# Altium schematic sheet STM32H7-Board.SchDoc
size A4
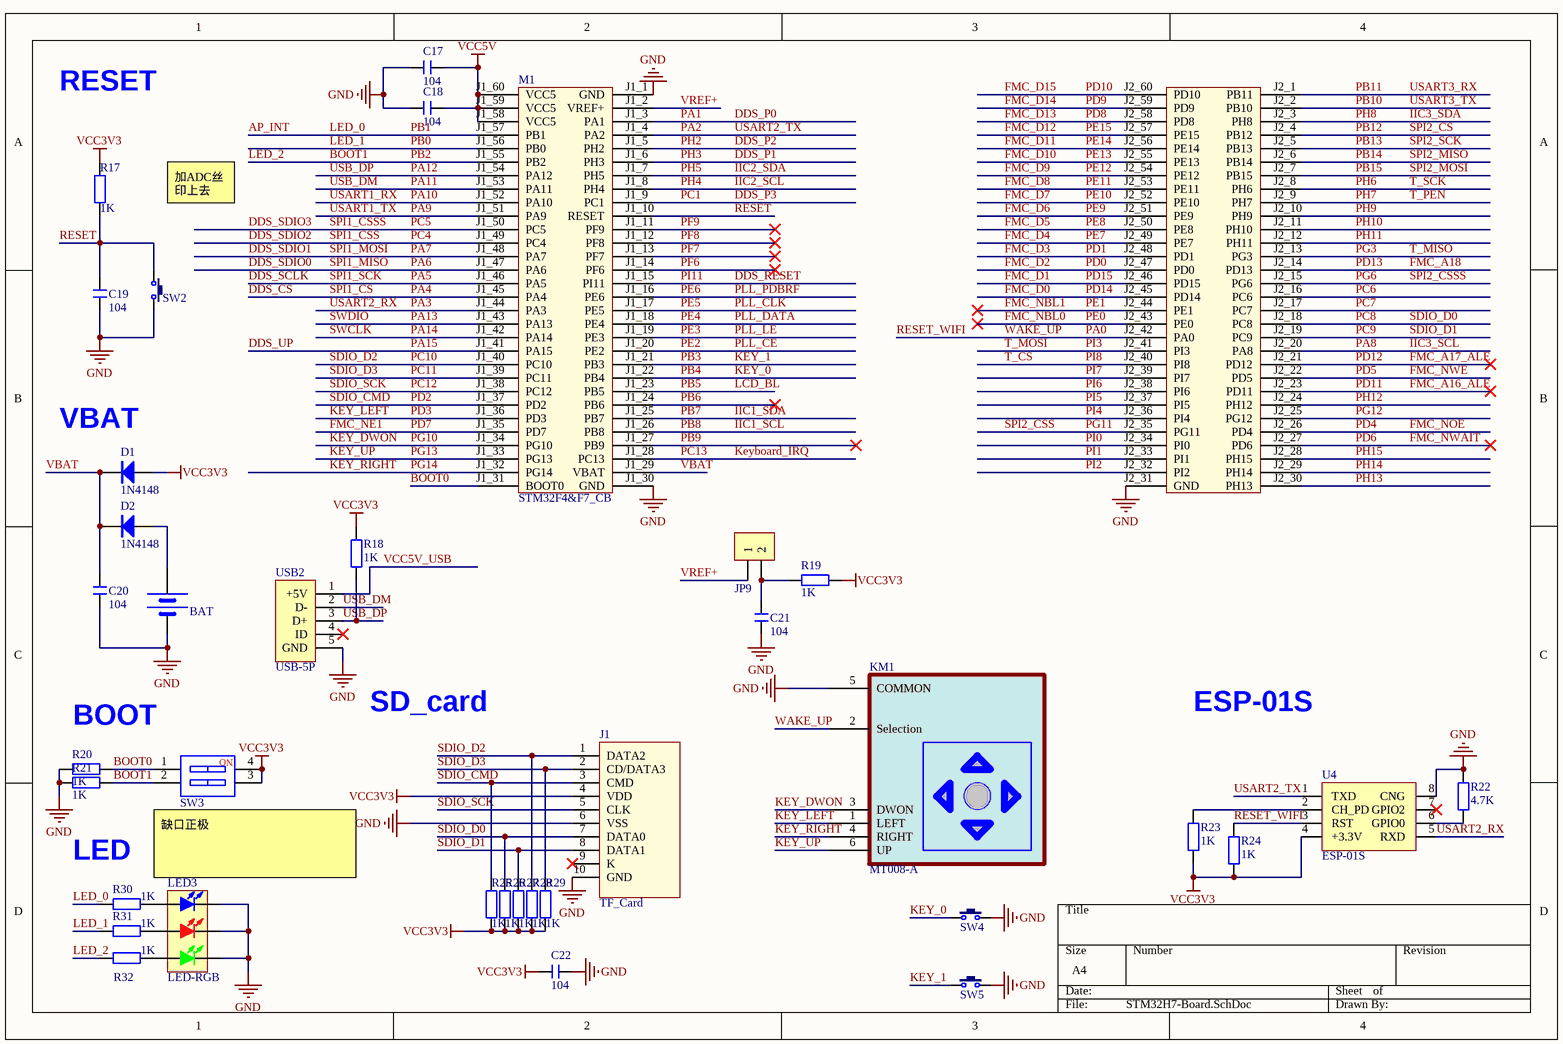
[diagram p0: STM32H7-Board.SchDoc]

## Parts
BAT  BATT  [BATM]  (value not drawn)
C17  104  [C 0603_L]
C18  104  [C 0603_L]
C19  104  [C 0603_L]
C20  104  [C 0603_L]
C21  104  [C 0603_L]
C22  104  [C 0603_L]
D1  1N4148  [SOD-323]
D2  1N4148  [MINI_MELF (LL34)]
J1  TF_Card  [Micro SD]
JP9  HDR-1X2  [HDR2.54-LI-2P]  (value not drawn)
KM1  MT008-A  [JOY_MT008-A]
LED3  LED-RGB  [LED 5050]
M1  STM32F4&F7_CB  [STM32F4&F7_CB]
R17  1K  [R 0603_L]
R18  1K  [R 0603_L]
R19  1K  [R 0603_L]
R20  1K  [R 0603_L]
R21  1K  [R 0603_L]
R22  4.7K  [R 0603_L]
R23  1K  [R 0603_L]
R24  1K  [R 0603_L]
R25  1K  [R 0603_L]
R26  1K  [R 0603_L]
R27  1K  [R 0603_L]
R28  1K  [R 0603_L]
R29  1K  [R 0603_L]
R30  1K  [R 0603_L]
R31  1K  [R 0603_L]
R32  1K  [R 0603_L]
SW2  3x6x5  [TSW SMD-3*6*2.5]  (value not drawn)
SW3  CSW-2P  [CSW1.27 SMD-2P]  (value not drawn)
SW4  3x6x5  [SODFL700X110-2N]  (value not drawn)
SW5  3x6x5  [SODFL700X110-2N]  (value not drawn)
U4  ESP-01S  [ESP-01S]
USB2  USB-5P  [USB-MICRO_B]

## Nets
GND: BAT.2(GND) C17.1 C18.1 C19.1 C20.1 C21.1 C22.2 J1.6(VSS) J1.10(GND) KM1.5(COMMON) LED3.2(BULE_K) LED3.4(RED_K) LED3.6(GREEN_K) M1.J1_1(GND) M1.J1_30(GND) M1.J2_31(GND) R20.1 R21.1 R22.2 SW2.2 SW4.2 SW5.2 U4.8(CNG) USB2.5(GND)
VCC3V3: C22.1 D1.1(A) J1.4(VDD) R17.2 R18.1 R19.2 R23.2 R24.2 R25.1 R26.1 R27.1 R28.1 R29.1 SW3.3 SW3.4 U4.4(+3.3V)
VCC5V: C17.2 C18.2 M1.J1_58(VCC5) M1.J1_59(VCC5) M1.J1_60(VCC5)
AP_INT: M1.J1_57(PB1) R30.2  [also labelled LED_0, PB1]
BOOT0: M1.J1_31(BOOT0) R20.2 SW3.1
BOOT1: M1.J1_55(PB2) R21.2 R32.2 SW3.2  [also labelled LED_2, PB2]
DDS_CS: M1.J1_45(PA4)  [also labelled PA4, SPI1_CS]
DDS_P0: M1.J1_3(PA1)  [also labelled PA1]
DDS_P1: M1.J1_6(PH3)  [also labelled PH3]
DDS_P2: M1.J1_5(PH2)  [also labelled PH2]
DDS_P3: M1.J1_9(PC1)  [also labelled PC1]
DDS_RESET: M1.J1_15(PI11)  [also labelled PI11]
DDS_SCLK: M1.J1_46(PA5)  [also labelled PA5, SPI1_SCK]
DDS_SDIO0: M1.J1_47(PA6)  [also labelled PA6, SPI1_MISO]
DDS_SDIO1: M1.J1_48(PA7)  [also labelled PA7, SPI1_MOSI]
DDS_SDIO2: M1.J1_49(PC4)  [also labelled PC4, SPI1_CSS]
DDS_SDIO3: M1.J1_50(PC5)  [also labelled PC5, SPI1_CSSS]
DDS_UP: M1.J1_41(PA15)  [also labelled PA15]
FMC_A16_ALE: M1.J2_23(PD11)  [also labelled PD11]
FMC_A17_ALE: M1.J2_21(PD12)  [also labelled PD12]
FMC_A18: M1.J2_14(PD13)  [also labelled PD13]
FMC_D0: M1.J2_45(PD14)  [also labelled PD14]
FMC_D1: M1.J2_46(PD15)  [also labelled PD15]
FMC_D2: M1.J2_47(PD0)  [also labelled PD0]
FMC_D3: M1.J2_48(PD1)  [also labelled PD1]
FMC_D4: M1.J2_49(PE7)  [also labelled PE7]
FMC_D5: M1.J2_50(PE8)  [also labelled PE8]
FMC_D6: M1.J2_51(PE9)  [also labelled PE9]
FMC_D7: M1.J2_52(PE10)  [also labelled PE10]
FMC_D8: M1.J2_53(PE11)  [also labelled PE11]
FMC_D9: M1.J2_54(PE12)  [also labelled PE12]
FMC_D10: M1.J2_55(PE13)  [also labelled PE13]
FMC_D11: M1.J2_56(PE14)  [also labelled PE14]
FMC_D12: M1.J2_57(PE15)  [also labelled PE15]
FMC_D13: M1.J2_58(PD8)  [also labelled PD8]
FMC_D14: M1.J2_59(PD9)  [also labelled PD9]
FMC_D15: M1.J2_60(PD10)  [also labelled PD10]
FMC_NBL0: M1.J2_43(PE0)  [also labelled PE0]
FMC_NBL1: M1.J2_44(PE1)  [also labelled PE1]
FMC_NE1: M1.J1_35(PD7)  [also labelled PD7]
FMC_NOE: M1.J2_26(PD4)  [also labelled PD4]
FMC_NWAIT: M1.J2_27(PD6)  [also labelled PD6]
FMC_NWE: M1.J2_22(PD5)  [also labelled PD5]
IIC1_SCL: M1.J1_26(PB8)  [also labelled PB8]
IIC1_SDA: M1.J1_25(PB7)  [also labelled PB7]
IIC2_SCL: M1.J1_8(PH4)  [also labelled PH4]
IIC2_SDA: M1.J1_7(PH5)  [also labelled PH5]
IIC3_SCL: M1.J2_20(PA8)  [also labelled PA8]
IIC3_SDA: M1.J2_3(PH8)  [also labelled PH8]
KEY_0: M1.J1_22(PB4) SW4.1  [also labelled PB4]
KEY_1: M1.J1_21(PB3) SW5.1  [also labelled PB3]
KEY_DWON: KM1.3(DWON) M1.J1_34(PG10)  [also labelled PG10]
KEY_LEFT: KM1.1(LEFT) M1.J1_36(PD3)  [also labelled PD3]
KEY_RIGHT: KM1.4(RIGHT) M1.J1_32(PG14)  [also labelled PG14]
KEY_UP: KM1.6(UP) M1.J1_33(PG13)  [also labelled PG13]
Keyboard_IRQ: M1.J1_28(PC13)  [also labelled PC13]
LCD_BL: M1.J1_23(PB5)  [also labelled PB5]
LED_1: M1.J1_56(PB0) R31.2  [also labelled PB0]
PA0: KM1.2(Selection) M1.J2_42(PA0) R24.1 U4.3(RST)  [also labelled RESET_WIFI, WAKE_UP]
PA2: M1.J1_4(PA2) U4.1(TXD)  [also labelled USART2_TX]
PA3: M1.J1_44(PA3) U4.5(RXD)  [also labelled USART2_RX]
PA9: M1.J1_51(PA9)  [also labelled USART1_TX]
PA10: M1.J1_52(PA10)  [also labelled USART1_RX]
PA11: M1.J1_53(PA11) USB2.2(D-)  [also labelled USB_DM]
PA12: M1.J1_54(PA12) R18.2 USB2.3(D+)  [also labelled USB_DP]
PA13: M1.J1_43(PA13)  [also labelled SWDIO]
PA14: M1.J1_42(PA14)  [also labelled SWCLK]
PB6: M1.J1_24(PB6)
PB9: M1.J1_27(PB9)
PB10: M1.J2_2(PB10)  [also labelled USART3_TX]
PB11: M1.J2_1(PB11)  [also labelled USART3_RX]
PB12: M1.J2_4(PB12)  [also labelled SPI2_CS]
PB13: M1.J2_5(PB13)  [also labelled SPI2_SCK]
PB14: M1.J2_6(PB14)  [also labelled SPI2_MISO]
PB15: M1.J2_7(PB15)  [also labelled SPI2_MOSI]
PC6: M1.J2_16(PC6)
PC7: M1.J2_17(PC7)
PC8: J1.7(DATA0) M1.J2_18(PC8) R26.2  [also labelled SDIO_D0]
PC9: J1.8(DATA1) M1.J2_19(PC9) R27.2  [also labelled SDIO_D1]
PC10: J1.1(DATA2) M1.J1_40(PC10) R28.2  [also labelled SDIO_D2]
PC11: J1.2(CD/DATA3) M1.J1_39(PC11) R29.2  [also labelled SDIO_D3]
PC12: J1.5(CLK) M1.J1_38(PC12)  [also labelled SDIO_SCK]
PD2: J1.3(CMD) M1.J1_37(PD2) R25.2  [also labelled SDIO_CMD]
PE2: M1.J1_20(PE2)  [also labelled PLL_CE]
PE3: M1.J1_19(PE3)  [also labelled PLL_LE]
PE4: M1.J1_18(PE4)  [also labelled PLL_DATA]
PE5: M1.J1_17(PE5)  [also labelled PLL_CLK]
PE6: M1.J1_16(PE6)  [also labelled PLL_PDBRF]
PF6: M1.J1_14(PF6)
PF7: M1.J1_13(PF7)
PF8: M1.J1_12(PF8)
PF9: M1.J1_11(PF9)
PG3: M1.J2_13(PG3)  [also labelled T_MISO]
PG6: M1.J2_15(PG6)  [also labelled SPI2_CSSS]
PG11: M1.J2_35(PG11)  [also labelled SPI2_CSS]
PG12: M1.J2_25(PG12)
PH6: M1.J2_8(PH6)  [also labelled T_SCK]
PH7: M1.J2_9(PH7)  [also labelled T_PEN]
PH9: M1.J2_10(PH9)
PH10: M1.J2_11(PH10)
PH11: M1.J2_12(PH11)
PH12: M1.J2_24(PH12)
PH13: M1.J2_30(PH13)
PH14: M1.J2_29(PH14)
PH15: M1.J2_28(PH15)
PI0: M1.J2_34(PI0)
PI1: M1.J2_33(PI1)
PI2: M1.J2_32(PI2)
PI3: M1.J2_41(PI3)  [also labelled T_MOSI]
PI4: M1.J2_36(PI4)
PI5: M1.J2_37(PI5)
PI6: M1.J2_38(PI6)
PI7: M1.J2_39(PI7)
PI8: M1.J2_40(PI8)  [also labelled T_CS]
RESET: C19.2 M1.J1_10(RESET) R17.1 SW2.1
VBAT: C20.2 D1.2(K) D2.2(K) M1.J1_29(VBAT)
VCC5V_USB: USB2.1(+5V)
VREF+: JP9.1 M1.J1_2(VREF+)
NetBAT_1: BAT.1(VCC) D2.1(A)
NetC21_2: C21.2 JP9.2 R19.1
NetLED3_1: LED3.1(BULE_A) R30.1
NetLED3_3: LED3.3(RED_A) R31.1
NetLED3_5: LED3.5(GREEN_A) R32.1
NetR22_1: R22.1 U4.6(GPIO0)
NetR23_1: R23.1 U4.2(CH_PD)

Not connected (* = marked no-connect by the designer): J1 9(K)*; U4 7(GPIO2)*; USB2 4(ID)*

## Notes on the sheet
- RESET
- 加ADC丝印上去
- (near D1) VBAT
- BOOT
- SD_card
- ESP-01S
- LED
- 缺口正极
- (in symbol CSW-2P) NO

## Library data of the parts
BAT = BAT
C17-C22 = C: 无极性贴片电容; 版权归属: 源创客; BOM名称: 无极性贴片电容; 学习资源: www.ooocke.com
D1 D2 = 1N4148: 高速开关二极管; 版权归属: 源创客; BOM名称: 高速开关二极管; 学习资源: www.ooocke.com
J1 = TF_Card: TF卡座; 版权归属: 源创客; BOM名称: TF卡座; 学习资源: www.ooocke.com
JP9 = Header 2: 2P接插件; 版权归属: 源创客; BOM名称: 2P接插件; 学习资源: www.ooocke.com
KM1 = MT-008A
LED3 = LED-RGB: 三基色LED; 版权归属: 源创客; BOM名称: 三基色LED; 学习资源: www.ooocke.com
M1 = STM32F4&F7_CB: F429/746 Core Board
R17-R32 = R: 贴片电阻; 版权归属: 源创客; BOM名称: 贴片电阻; 学习资源: www.ooocke.com
SW2 SW4 SW5 = TSW 3x6: 3x6轻触开关; 版权归属: 源创客; BOM名称: 3x6轻触开关; 学习资源: www.ooocke.com
SW3 = CSW-2P: 2路编码开关; 版权归属: 源创客; BOM名称: 2路编码开关; 学习资源: www.ooocke.com
USB2 = USB-5P: 微型USB母座; 版权归属: 源创客; BOM名称: 微型USB母座; 学习资源: www.ooocke.com